# Altium project Pro Co RAT.PrjPcb
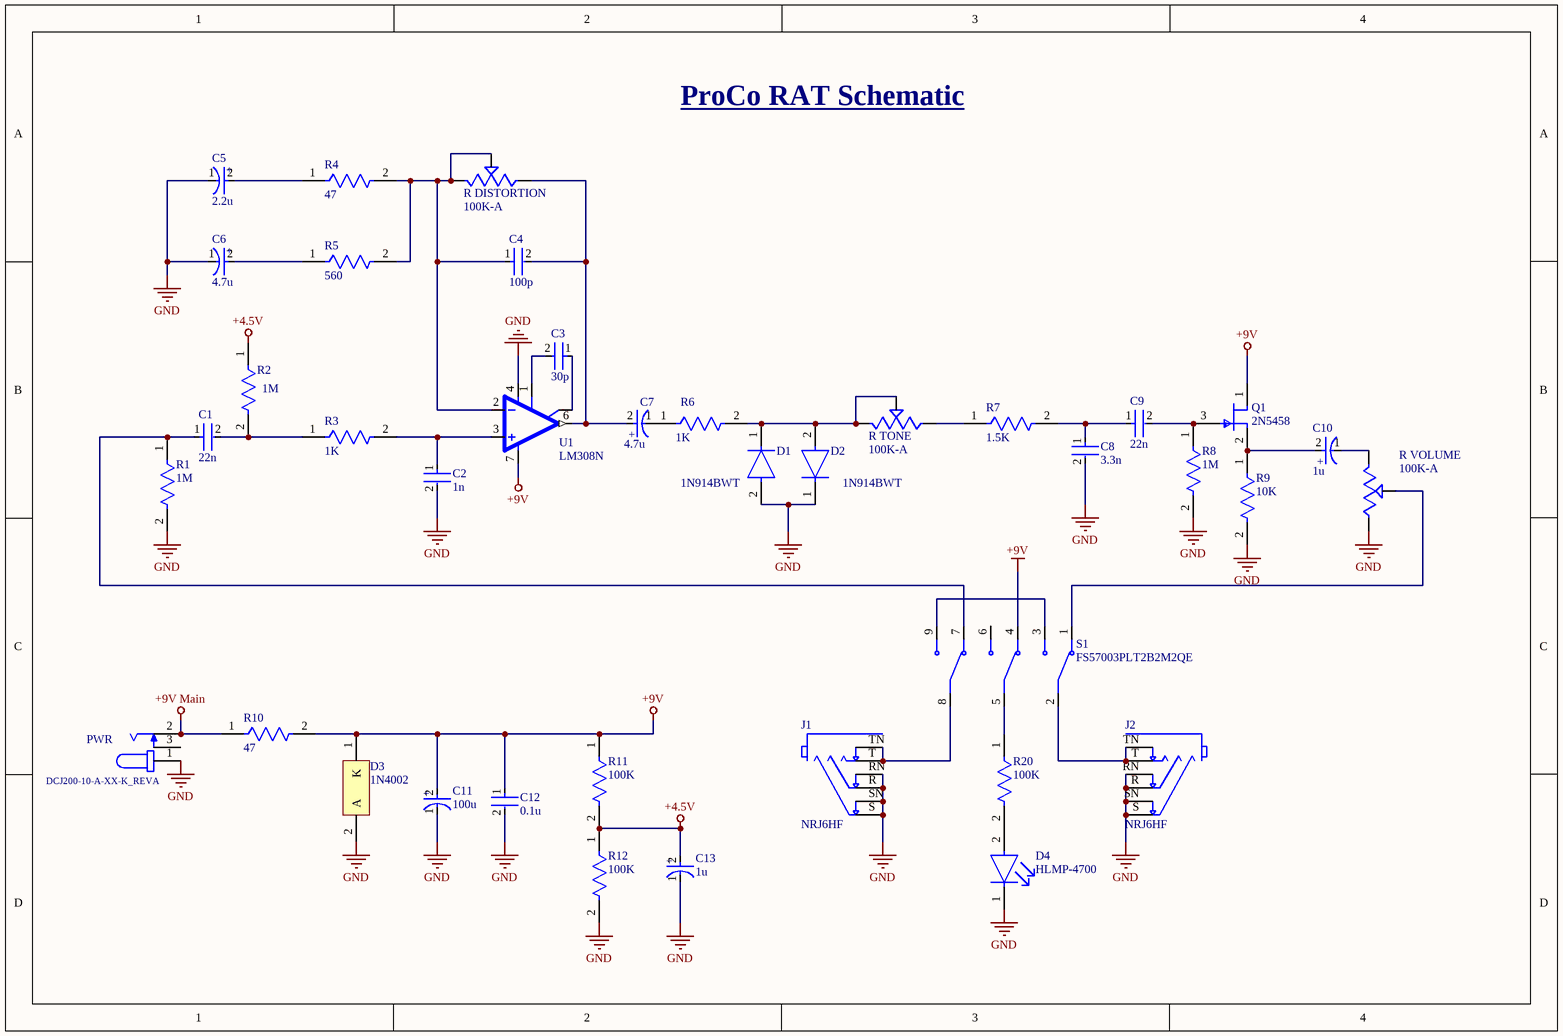
[diagram p0: Pro Co RAT.SchDoc]
1 sheet, 39 parts. Net scope: global (net labels, ports and power ports of the same name join across sheets).
Board file: ProCo RAT.PcbDoc

## Sheet Pro Co RAT.SchDoc
size A4; SheetNumber: 1; SheetTotal: 1

### Parts
C1  22n  [FP-VY2332M41Y5US63V7-MFG]
C2  1n  [FP-VY2332M41Y5US63V7-MFG]
C3  30p  [FP-VY2332M41Y5US63V7-MFG]
C4  100p  [FP-VY2332M41Y5US63V7-MFG]
C5  2.2u  [FP-RAD-TH-D_8_0_5-L_11_5-MFG]
C6  4.7u  [FP-RAD-TH-D_8_0_5-L_11_5-MFG]
C7  4.7u  [FP-RAD-TH-D_8_0_5-L_11_5-MFG]
C8  3.3n  [FP-VY2332M41Y5US63V7-MFG]
C9  22n  [FP-VY2332M41Y5US63V7-MFG]
C10  1u  [FP-RAD-TH-D_8_0_5-L_11_5-MFG]
C11  100u  [FP-RAD-TH-D_8_0_5-L_11_5-MFG]
C12  0.1u  [FP-VY2332M41Y5US63V7-MFG]
C13  1u  [FP-RAD-TH-D_8_0_5-L_11_5-MFG]
D1  1N914BWT  [FP-502-01-MFG]
D2  1N914BWT  [FP-502-01-MFG]
D3  1N4002  [ONSC-AXIAL_LEAD-2-59-10_P]
D4  HLMP-4700  [FP-HLMP-4700-MFG]
J1  NRJ6HF  [NEUTRIK_NRJ6HF]
J2  NRJ6HF  [NEUTRIK_NRJ6HF]
PWR  DCJ200-10-A-XX-K_REVA  [GCT_DCJ200-10-A-XX-K_REVA]
Q1  2N5458  [FP-29-11-MFG]
R1  1M  [FP-MFR-25-MFG]
R2  1M  [FP-MFR-25-MFG]
R3  1K  [FP-MFR-25-MFG]
R4  47  [FP-MFR-25-MFG]
R5  560  [FP-MFR-25-MFG]
R6  1K  [FP-MFR-25-MFG]
R7  1.5K  [FP-MFR-25-MFG]
R8  1M  [FP-MFR-25-MFG]
R9  10K  [FP-MFR-25-MFG]
R10  47  [FP-MFR-25-MFG]
R11  100K  [FP-MFR-25-MFG]
R12  100K  [FP-MFR-25-MFG]
R20  100K  [FP-MFR-25-MFG]
R_DISTORTION  100K-A  [POT_RD901F-40-15R1-B100K-00DL1]
R_TONE  100K-A  [POT_RD901F-40-15R1-B100K-00DL1]
R_VOLUME  100K-A  [POT_RD901F-40-15R1-B100K-00DL1]
S1  FS57003PLT2B2M2QE  [SW_FS57003PLT2B2M2QE]
U1  LM308N  [DIL08]

### Nets
+4.5V: C13.2(A) R2.1 R11.2 R12.1
+9V: C11.2(A) C12.1 D3.1(K) Q1.1(DRAIN) R10.2 R11.1 S1.4 U1.7(V+)
+9V Main: PWR.2 R10.1
GND: C2.2 C5.1(C) C6.1(C) C8.2 C11.1(C) C12.2 C13.1(C) D1.2(A) D2.1(C) D3.2(A) D4.1(C) J1.R J1.RN J1.S J1.SN J2.R J2.RN J2.S J2.SN PWR.1 R1.2 R8.2 R9.2 R12.2 R_VOLUME.1 U1.4(V-)
NetC1_1: C1.1 R1.1 S1.7
NetC1_2: C1.2 R2.2 R3.1
NetC2_1: C2.1 R3.2 U1.3(+IN)
NetC3_1: C3.1 U1.8(CMP2)
NetC3_2: C3.2 U1.1(CMP1)
NetC4_1: C4.1 R4.2 R5.2 R_DISTORTION.2 R_DISTORTION.3 U1.2(-IN)
NetC4_2: C4.2 C7.2(A) R_DISTORTION.1 U1.6(OUT)
NetC5_2: C5.2(A) R4.1
NetC6_2: C6.2(A) R5.1
NetC7_1: C7.1(C) R6.1
NetC8_1: C8.1 C9.1 R7.2
NetC9_2: C9.2 Q1.3(GATE) R8.1
NetC10_1: C10.1(C) R_VOLUME.3
NetC10_2: C10.2(A) Q1.2(SOURCE) R9.1
NetD1_1: D1.1(C) D2.2(A) R6.2 R_TONE.2 R_TONE.3
NetD4_2: D4.2(A) R20.2
NetJ1_T: J1.T J1.TN S1.8
NetJ2_T: J2.T J2.TN S1.2
NetR7_1: R7.1 R_TONE.1
NetR20_1: R20.1 S1.5
NetR_VOLUME_2: R_VOLUME.2 S1.1
NetS1_3: S1.3 S1.9

Not connected (* = marked no-connect by the designer): PWR 3; S1 6

### Notes on the sheet
- ProCo RAT Schematic
- (in symbol CMP-05427-000255-1) +

### Library data of the parts
C1-C4 C8 C9 C12 = CMP-00030-44060233-1: Capacitor Radiall; Voltage Rating (DC): 300V; Dissipation Factor: 2.5%; Lead Diameter: 600µm; Lead Length: 30mm; Dielectric: Y5U; Tolerance: 20%; Lead/Base Style: Kinked; Capacitance: 3.3nF; Lead Pitch: 7.5mm; NexarPartId: 44060233; Thickness: 5mm; Lead Free: Lead Free; Height - Seated (Max): 14.5034mm; Mount: Through Hole; RoHS: Compliant; Width: 10.5mm; Termination: Radial; Max Operating Temperature: 125°C; Schedule B: 8532230060, 8532230060; Radiation Hardening: No; Diameter: 10.5mm; Depth: 5mm; Min Operating Temperature: -40°C; Case/Package: Radial; Voltage Rating (AC): 300V; REACH SVHC: Unknown; Packaging: Bulk; Composition: Ceramic
C5-C7 C10 C11 C13 = CMP-05427-000255-1: Aluminum Electrolytic Capacitors (Radial Lead Type) 680uF ±20% 10V; Ripple Current (AC): 950mA; Lead/Base Style: Straight; Lead Diameter: 0.6mm; Impedance: 56mR; Life (Hours): 6000Hour; Radiation Hardening: No; Height - Seated (Max): 0.512inch; Voltage Rating (DC): 10V; REACH SVHC: No SVHC; Termination: Radial; Length: 11.5mm; Series: FR; Packaging: Bulk; Lead Pitch: 3.5mm; Construction: RADIAL; Min Operating Temperature: -40°C; Height: 11.5mm; Contact Plating: Tin; Diameter: 8mm; Capacitance: 680uF; Max Operating Temperature: 105°C; Tolerance: 20%; Voltage: 10V; Package Quantity: 200; Case/Package: Radial; Voltage Rating: 10V; RoHS Compliant: Yes; Mount: Through Hole; ESR (Equivalent Series Resistance): 56mR; Ripple Current: 950mA; Lead Free: Lead Free; Number of Pins: 2
D1 D2 = CMP-07163-000008-1: DIODE GEN PURP 75V 200MA SOD523F; Manufacturer: ON Semiconductor; Forward Current: 300mA; Capacitance: 4pF; Max Junction Temp: +150°C; Reverse Voltage: 100V; Value: 4pF; Peak Reverse Current: 5uA; ComponentLink2Description: Datasheet; Package: 502-01; Manufacturer Part Number: 1N914BWT; Digikey Description: DIODE GEN PURP 75V 200MA SOD523F; Temperature Range High: +150°C; Temperature: -55°C to +150°C; Footprint Url: https://www.onsemi.com/pub/Collateral/502-01.PDF; Device Class L2: Diodes; Lead Free: Yes; Automotive: No; Category: Diode; Octopart: https://octopart.com/1n914bwt-on+semiconductor-84323166; Device Class L1: Discrete Semiconductors; Ipc Land Pattern Name: SODFL16080X60; Device Class L3: Rectifier Diodes; Height: 0.7mm; Max Repetitive Reverse Voltage: 75V; Mouser Description: Diodes - General Purpose, Power, Switching SINGLE JUNC. 100V 4.0NS COMP; Temperature Range Low: -55°C; ComponentLink2URL: https://www.onsemi.com/pub/Collateral/1N914BWT-D.pdf; RoHS: TRUE
D3 = CMP-0902-00207-1: Standard Recovery Rectifier, 2-Pin Axial_Lead, Pb-Free, Bulk Bag; Manufacturer: On Semiconductor; IO(rec) Max (A): 1; IFSM Max (A): 30; VRRM Max (V): 100; ComponentLink3Description: Package Specification; ComponentLink1Description: Manufacturer URL; Type: Standard Recovery; PackageVersion: Rev. U, 02/2005; Mounting Technology: Through Hole; ComponentLink1URL: http://www.onsemi.com/; ComponentLink3URL: http://www.onsemi.cn/pub_link/Collateral/59-10.PDF; ComponentLink2URL: http://www.onsemi.com/pub_link/Collateral/1N4001-D.PDF; Packing: Bulk Bag; PackageDescription: 2-Pin, Axial Lead, Diameter 2.35 mm; ComponentLink2Description: Datasheet; PartNumber: 1N4002; DatasheetVersion: Rev. 13; PackageReference: AXIAL_LEAD-2-59-10; RoHS: TRUE
D4 = CMP-18399-000008-1: LED RED DIFFUSED T-1 3/4 T/H; Manufacturer: Broadcom; Luminous Intensity: 2.3mcd; Peak Emmision Wavelength: 635nm; Forward Voltage: 1.7V; Viewing Angle: 50°; Led Orientation: Straight; Reverse Voltage: 5V; Forward Current: 2mA; Power Dissipation: 14mW; Wavelength: 626nm; Digikey Description: LED RED DIFFUSED T-1 3/4 T/H; Device Class L3: unset; Temperature Range Low: -40°C; Temperature Range High: +100°C; RoHS: TRUE; Package: HLMP-4700; Octopart: https://octopart.com/hlmp-4700-broadcom-71130526; Automotive: No; ComponentLink2URL: https://docs.broadcom.com/docs/AV02-1557EN; Colour: Red; Temperature: -40°C to +100°C; Lead Free: Yes; Category: Diode; ComponentLink2Description: Datasheet; Manufacturer Part Number: HLMP-4700; Device Class L1: Optoelectronics; Device Class L2: LEDs; Mouser Description: LED; Red; 2.3mcd; 0.24In.Dia.; T-1-3/4; 500mA; 1.7V; 635nm; 50deg; 5V; 24mW; -55degC;
J1 J2 = NRJ6HF: Jack Phone 1/4 in. Silver over Bronze cnts Horizontal PCB, Slim Jacks Series | Neutrik NRJ6HF; SnapEDA_Link: https://www.snapeda.com/parts/NRJ6HF/Neutrik/view-part/?ref=snap; Package: None; Value: *; MF: Neutrik; MP: NRJ6HF; Check_prices: https://www.snapeda.com/parts/NRJ6HF/Neutrik/view-part/?ref=eda
PWR = DCJ200-10-A-XX-K_REVA: Power Barrel Connector Jack 2.05mm ID (0.081), 5.50mm OD (0.217) Through Hole, Right Angle; MF: Global Connector Technology; MP: DCJ200-10-A-K1-K; SnapEDA_Link: https://www.snapeda.com/parts/DCJ200-10-A-K1-K/Global+Connector+Technology/view-part/?ref=snap; Package: None; Value: *; Check_prices: https://www.snapeda.com/parts/DCJ200-10-A-K1-K/Global+Connector+Technology/view-part/?ref=eda
Q1 = CMP-00278-00153544-1: 2N5458 Small Signal Field-Effect Transistor, 25V, 1-Element, N-Channel, Silicon, Junction FET, TO-92; NexarPartId: 153544; Manufacturer Lifecycle Status: OBSOLETE; Element Configuration: Single; Power Dissipation: 625mW; Input Capacitance: 7pF; Max Junction Temperature (Tj): 135°C; Continuous Drain Current (ID): 9mA; Gate to Source Voltage (Vgs): -25V; Number of Channels: 1; Current Rating: 10mA; Drain to Source Voltage (Vdss): 25V; Max Operating Temperature: 135°C; Number of Pins: 3; Weight: 201mg; Breakdown Voltage: 25V; Lead Free: Lead Free; Case/Package: TO-92; Lifecycle Status: Obsolete; RoHS: Compliant; Packaging: Bulk; Min Operating Temperature: -55°C; Height: 7.87mm; Mount: Through Hole; Drain to Source Breakdown Voltage: 25V; REACH SVHC: No SVHC; Max Power Dissipation: 625mW; Voltage Rating (DC): 25V
R1-R12 R20 = CMP-03413-000001-1: RES 1.18K OHM 1/4W 1% AXIAL; Manufacturer: Yageo; Manufacturer Part Number: MFR-25FBF52-1K18; Value: 1.18kΩ; Temperature Coefficient: 100ppm/°C; Power Rating: 0.25W; Voltage Rating: 250V; Temperature: -55°C to +155°C; Automotive: No; Temperature Range High: +155°C; Mouser Description: Metal Film Resistors 1.18K OHM 1/4W 1%; Digikey Description: RES 1.18K OHM 1/4W 1% AXIAL; Lead Free: Yes; Tolerance: 1%; ComponentLink2Description: Datasheet; ComponentLink2URL: https://www.yageo.com/upload/media/product/products/datasheet/lr/Yageo_LR_MFR_1.pdf; Temperature Range Low: -55°C; Package: MFR-25; Ipc Land Pattern Name: RESAD1000W75L680D260; Composition: Metal Film; Category: Res; Octopart: https://octopart.com/mfr-25fbf52-1k18-yageo-56251681; Series: MFR; Device Class L2: Resistors; Height: 2.6mm; Resistance: 1.18kΩ; Device Class L3: Through-Hole Resistors; RoHS: TRUE; Device Class L1: Passive Components
R_DISTORTION R_TONE R_VOLUME = RD901F-40-15R1-B100K-00DL1: Potentiometers 9mm Linear 100K Round Shaft; MF: Alpha (Taiwan); SnapEDA_Link: https://www.snapeda.com/parts/RD901F-40-15R1-B100K-00DL1/Alpha+Taiwan/view-part/?ref=snap; Package: None; Value: *; MP: RD901F-40-15R1-B100K-00DL1; Check_prices: https://www.snapeda.com/parts/RD901F-40-15R1-B100K-00DL1/Alpha+Taiwan/view-part/?ref=eda
S1 = FS57003PLT2B2M2QE: Pushbutton Switch, FS5700 Series, 3PDT, Round Actuator, ON-ON, 1A, 9VDC,Solder | E-Switch FS57003PLT2B2M2QE; SnapEDA_Link: https://www.snapeda.com/parts/FS57003PLT2B2M2QE/E-Switch/view-part/?ref=snap; Package: None; Value: *; MF: E-Switch; MP: FS57003PLT2B2M2QE; Check_prices: https://www.snapeda.com/parts/FS57003PLT2B2M2QE/E-Switch/view-part/?ref=eda
U1 = LM308N: Ic 8-Pin Dip Op Amp Single Bipolar Ic 8-Pin Dip Op Amp Single Bipolar; MF: MCM Electronics; SnapEDA_Link: https://www.snapeda.com/parts/LM308N/MCM+Electronics/view-part/?ref=snap; Package: DIP-8 MCM Electronics; Value: *; MP: LM308N; Check_prices: https://www.snapeda.com/parts/LM308N/MCM+Electronics/view-part/?ref=eda